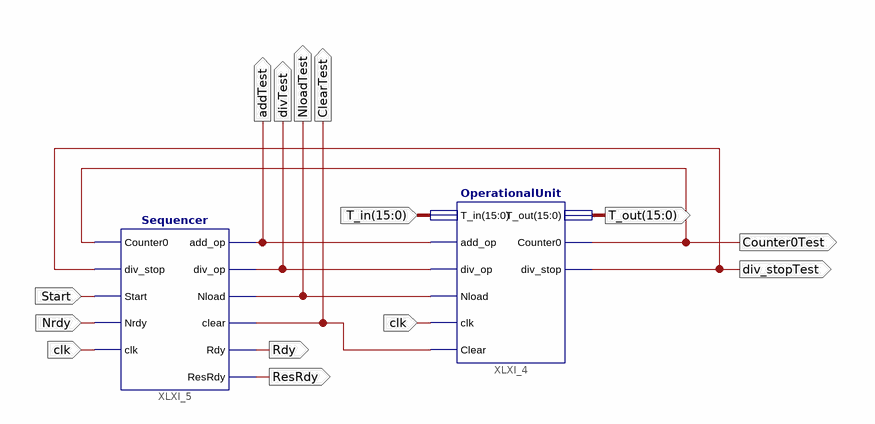
[diagram p0: schematic sheet 1]
// Xilinx ISE schematic WholeProject.sch (spartan3a) as structural Verilog: 2 symbols, 13 ports
module WholeProject (
  input  [15:0] T_in,
  input  clk,
  input  Start,
  input  Nrdy,
  output addTest,
  output divTest,
  output NloadTest,
  output ClearTest,
  output Counter0Test,
  output div_stopTest,
  output [15:0] T_out,
  output ResRdy,
  output Rdy
);

  OperationalUnit XLXI_4 (
    .T_in(T_in), .add_op(addTest), .div_op(divTest), .Nload(NloadTest), .clk(clk), .Clear(ClearTest),
    .T_out(T_out), .Counter0(Counter0Test), .div_stop(div_stopTest));
  Sequencer XLXI_5 (
    .Start(Start), .clk(clk), .Nrdy(Nrdy), .Counter0(Counter0Test), .div_stop(div_stopTest), .ResRdy(ResRdy),
    .clear(ClearTest), .Nload(NloadTest), .Rdy(Rdy), .add_op(addTest), .div_op(divTest));
endmodule
